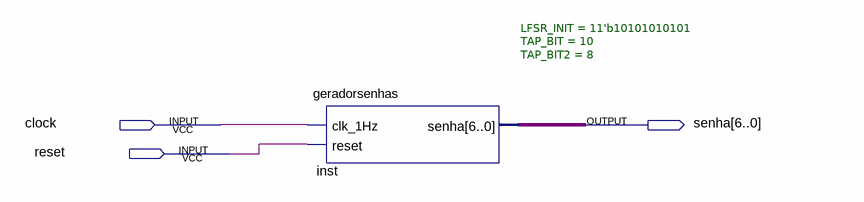
[diagram p0: schematic sheet]
// Quartus schematic esquematicogeradorsenhas.bdf as structural Verilog: 1 symbols, 3 pins
module esquematicogeradorsenhas (
  input  clock,
  input  reset,
  output [6:0] senha
);

  geradorsenhas #(.LFSR_INIT(11'b10101010101), .TAP_BIT(10), .TAP_BIT2(8)) inst (
    .clk_1Hz(clock), .reset(reset), .senha(senha));
endmodule
